# Altium schematic sheet USB_DVI.SchDoc
size A4; SheetNumber: 1; SheetTotal: 1
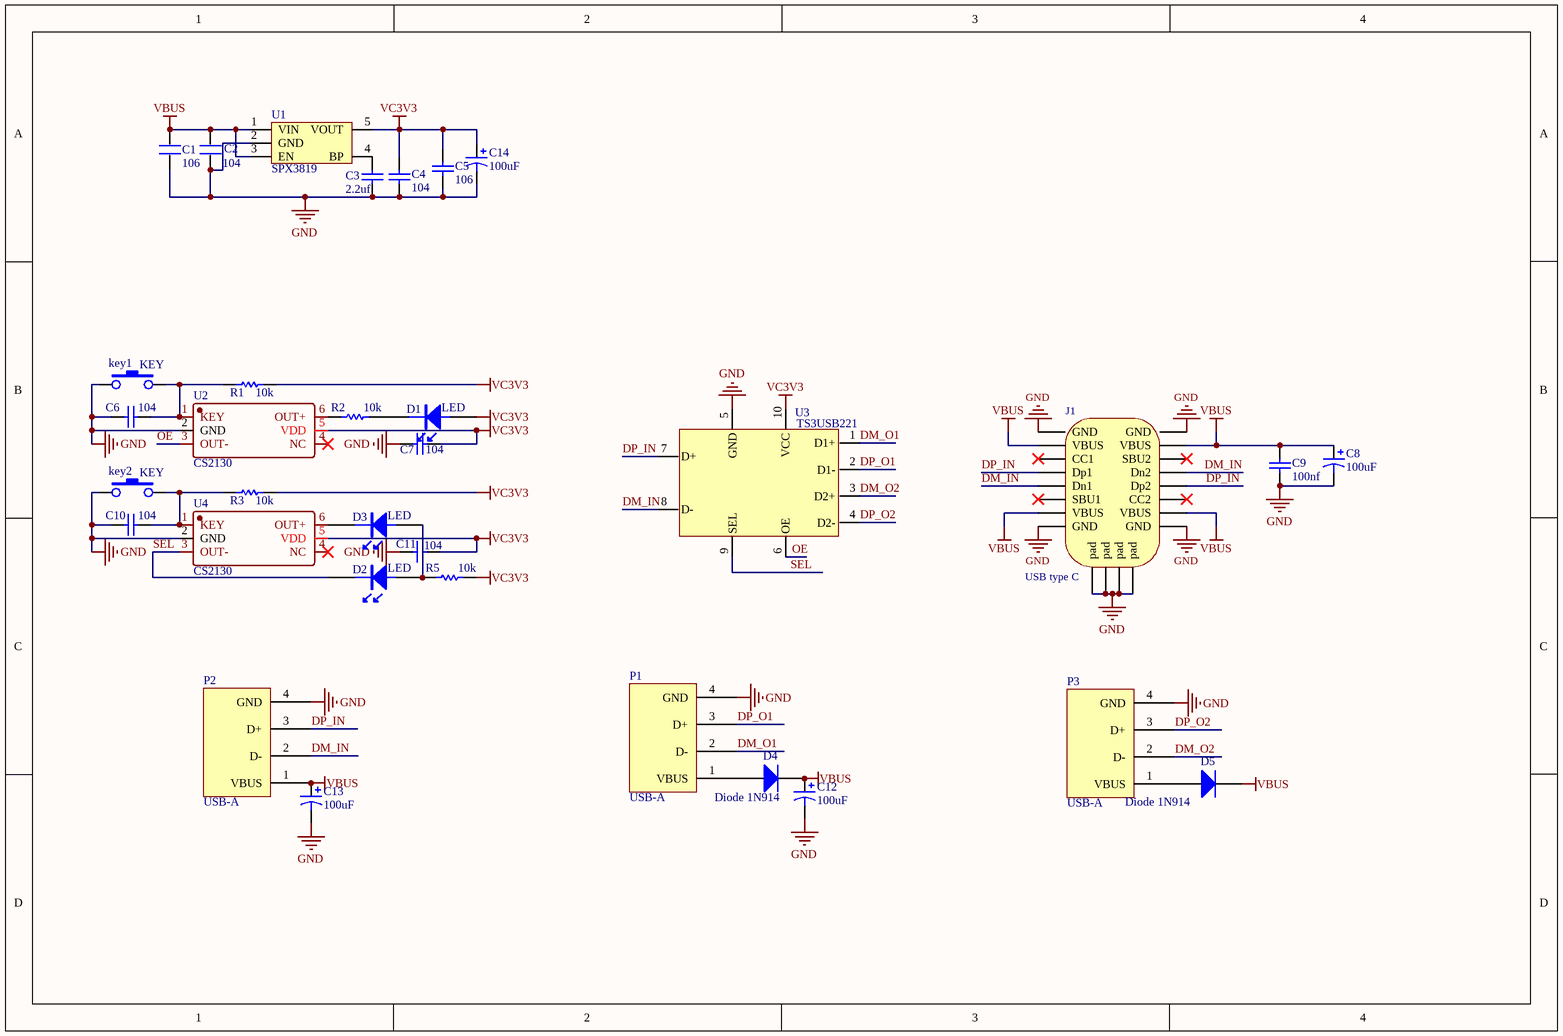
[diagram p0: USB_DVI.SchDoc]

## Parts
C1  106  [C 0603]
C2  104  [C 0603]
C3  value 2.2uf  [C 0603]  (hidden comment: Cap)
C4  value 104  [C 0603]  (hidden comment: Cap)
C5  value 106  [C 0603]  (hidden comment: Cap)
C6  value 104  [C 0603]  (hidden comment: Cap)
C7  value 104  [C 0603]  (hidden comment: Cap)
C8  100uF  [C 1210]
C9  100nf  [C 0603]
C10  value 104  [C 0603]  (hidden comment: Cap)
C11  value 104  [C 0603]  (hidden comment: Cap)
C12  100uF  [C 1210]
C13  100uF  [C 1210]
C14  100uF  [C 1210]
D1  LED  [LED 0603B]
D2  LED  [LED 0603B]
D3  LED  [LED 0603B]
D4  Diode 1N914  [SOD-323]
D5  Diode 1N914  [SOD-323]
J1  USB type C  [TYPEC_D]
key1  KEY  [KEY - duplicate]
key2  KEY  [KEY - duplicate]
P1  USB-A  [USB-A]
P2  USB-A  [USB-A]
P3  USB-A  [USB-A]
R1  10k  [R 0603]
R2  10k  [R 0603]
R3  10k  [R 0603]
R5  10k  [R 0603]
U1  SPX3819  [SOT23-5N]
U2  CS2130  [SOT23-6L]
U3  TS3USB221  [UQFN-10_L2.0-W1.5-P0.50-BL]
U4  CS2130  [SOT23-6L]

## Nets
GND: C1.1 C2.1 C3.1 C4.1 C5.1 C6.2 C7.2 C8.2 C9.2 C10.2 C11.2 C12.2 C13.2 C14.2 J1.1(pad) J1.A1(GND) J1.A12(GND) J1.B1(GND) J1.B12(GND) key1.1 key2.1 P1.4(GND) P2.4(GND) P3.4(GND) U1.2(GND) U2.2(GND) U3.5(GND) U4.2(GND)
VBUS: C1.2 C2.2 C8.1 C9.1 C12.1 C13.1 D4.2(K) D5.2(K) J1.A4(VBUS) J1.A9(VBUS) J1.B4(VBUS) J1.B9(VBUS) P2.1(VBUS) U1.1(VIN) U1.3(EN)
VC3V3: C4.2 C5.2 C7.1 C11.1 C14.1 D1.1 R1.1 R3.1 R5.1 U1.5(VOUT) U2.5(VDD) U3.10(VCC) U4.5(VDD)
DM_IN: J1.A7(Dn1) J1.B7(Dn2) P2.2(D-) U3.8(D-)
DM_O1: P1.2(D-) U3.1(D1+)
DM_O2: P3.2(D-) U3.3(D2+)
DP_IN: J1.A6(Dp1) J1.B6(Dp2) P2.3(D+) U3.7(D+)
DP_O1: P1.3(D+) U3.2(D1-)
DP_O2: P3.3(D+) U3.4(D2-)
OE: U2.3(OUT-) U3.6(OE)
SEL: D2.2 U3.9(SEL) U4.3(OUT-)
NetC3_2: C3.2 U1.4(BP)
NetC6_1: C6.1 key1.2 R1.2 U2.1(KEY)
NetC10_1: C10.1 key2.2 R3.2 U4.1(KEY)
NetD1_2: D1.2 R2.1
NetD2_1: D2.1 D3.1 R5.2
NetD3_2: D3.2 U4.6(OUT+)
NetD4_1: D4.1(A) P1.1(VBUS)
NetD5_1: D5.1(A) P3.1(VBUS)
NetR2_2: R2.2 U2.6(OUT+)

Not connected (* = marked no-connect by the designer): J1 A5(CC1)* A8(SBU1)* B5(CC2)* B8(SBU2)*; U2 4(NC)*; U4 4(NC)*

## Library data of the parts
C1 C2 = 0603C
C3-C7 C10 C11 = Cap: Polarized Capacitor (Radial); Published: 8-Jun-2000; Revision: July-2002: Re-released for DXP Platform.; Publisher: Altium Limited
C8 C12-C14 = Cap Pol1: 贴片电解电容; Value: 22uF; Published: 8-Jun-2000; LatestRevisionDate: 17-Jul-2002; LatestRevisionNote: Re-released for DXP Platform.; PackageReference: RB7.6-15; Publisher: Altium Limited; PackageDescription: Polarized Capacitor (Radial); 2 Leads
C9 = Cap: 贴片电容; Published: 8-Jun-2000; LatestRevisionDate: 17-Jul-2002; LatestRevisionNote: Re-released for DXP Platform.; PackageReference: RAD-0.3; Publisher: Altium Limited; PackageDescription: Radial Cap, Thru-Hole; 2 Leads; 0.3 in Pin Spacing
D4 D5 = Diode 1N914: High Conductance Fast Diode; Published: 8-Jun-2000; LatestRevisionDate: 17-Jul-2002; LatestRevisionNote: Re-released for DXP Platform.; DatasheetVersion: 1997; PackageReference: DO-35; Publisher: Altium Limited; PackageDescription: Diode, Axial; Body 3.8 x 1.9 mm (LxDia. max), Lead Dia. 0.53 mm (max); Code_JEDEC: DO-204-AH; ComponentLink1Description: Manufacturer Link; ComponentLink1URL: http://www.fairchildsemi.com/; ComponentLink2Description: Datasheet; ComponentLink2URL: http://www.fairchildsemi.com/ds/1N%2F1N4448.pdf
J1 = USB type C: USB type C 16P
R1-R3 R5 = Res1: 贴片电阻; Published: 8-Jun-2000; LatestRevisionDate: 17-Jul-2002; LatestRevisionNote: Re-released for DXP Platform.; PackageReference: AXIAL-0.3; Publisher: Altium Limited; PackageDescription: Axial Device, Thru-Hole; 2 Leads; 0.3 in Pin Spacing
U1 = RT9193-33: 3.3V超低压差LDO